# Altium schematic sheet ADC.SchDoc
size B
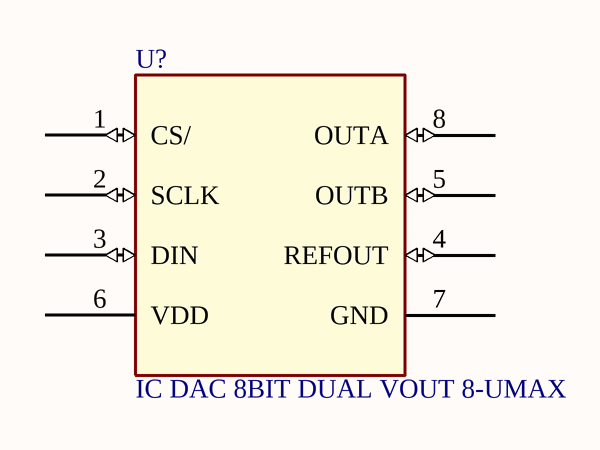
[diagram p0: ADC.SchDoc]

## Parts
U?  IC DAC 8BIT DUAL VOUT 8-UMAX  [TSOP65P490X110-8M]

## Nets

Not connected (* = marked no-connect by the designer): U? 1(CS/) 2(SCLK) 3(DIN) 4(REFOUT) 5(OUTB) 6(VDD) 7(GND) 8(OUTA)

## Notes on the sheet
- ESE
- is the sole property of ESE. Any reproduction
- The Information Contained in this drawing
- Schematic P/N and Name
- Sheet Name
- 299 Doon Valley Drive
- Kitchener, ON N2G 4M4
- Canada
- Approved
- in part or in whole without the written
- permission of ESE is strictly prohibited.
- APPROVALS
- DATE
- Size
- Scale
- B
- NTS
- Bare PCB P/N
- Date
- Sheet
- Rev.
- Checked
- Engineer
- of

## Library data of the parts
U? = Max5513-dac: MPN: MAX5513EUA+; PN: MAX5513EUA+-ND; URL: http://www.digikey.ca/product-detail/en/MAX5513EUA%2B/MAX5513EUA%2B-ND